# Altium schematic sheet [07] - CPU CONNECTORS .SchDoc (part 1 of 2)
size A2; Organization: Altium Limited; Address1: L3, 12a Rodborough Rd; Address2: Frenchs Forest; Address3: NSW; Address4: Australia 2086; DocumentNumber: 7; SheetNumber: 7; SheetTotal: 11
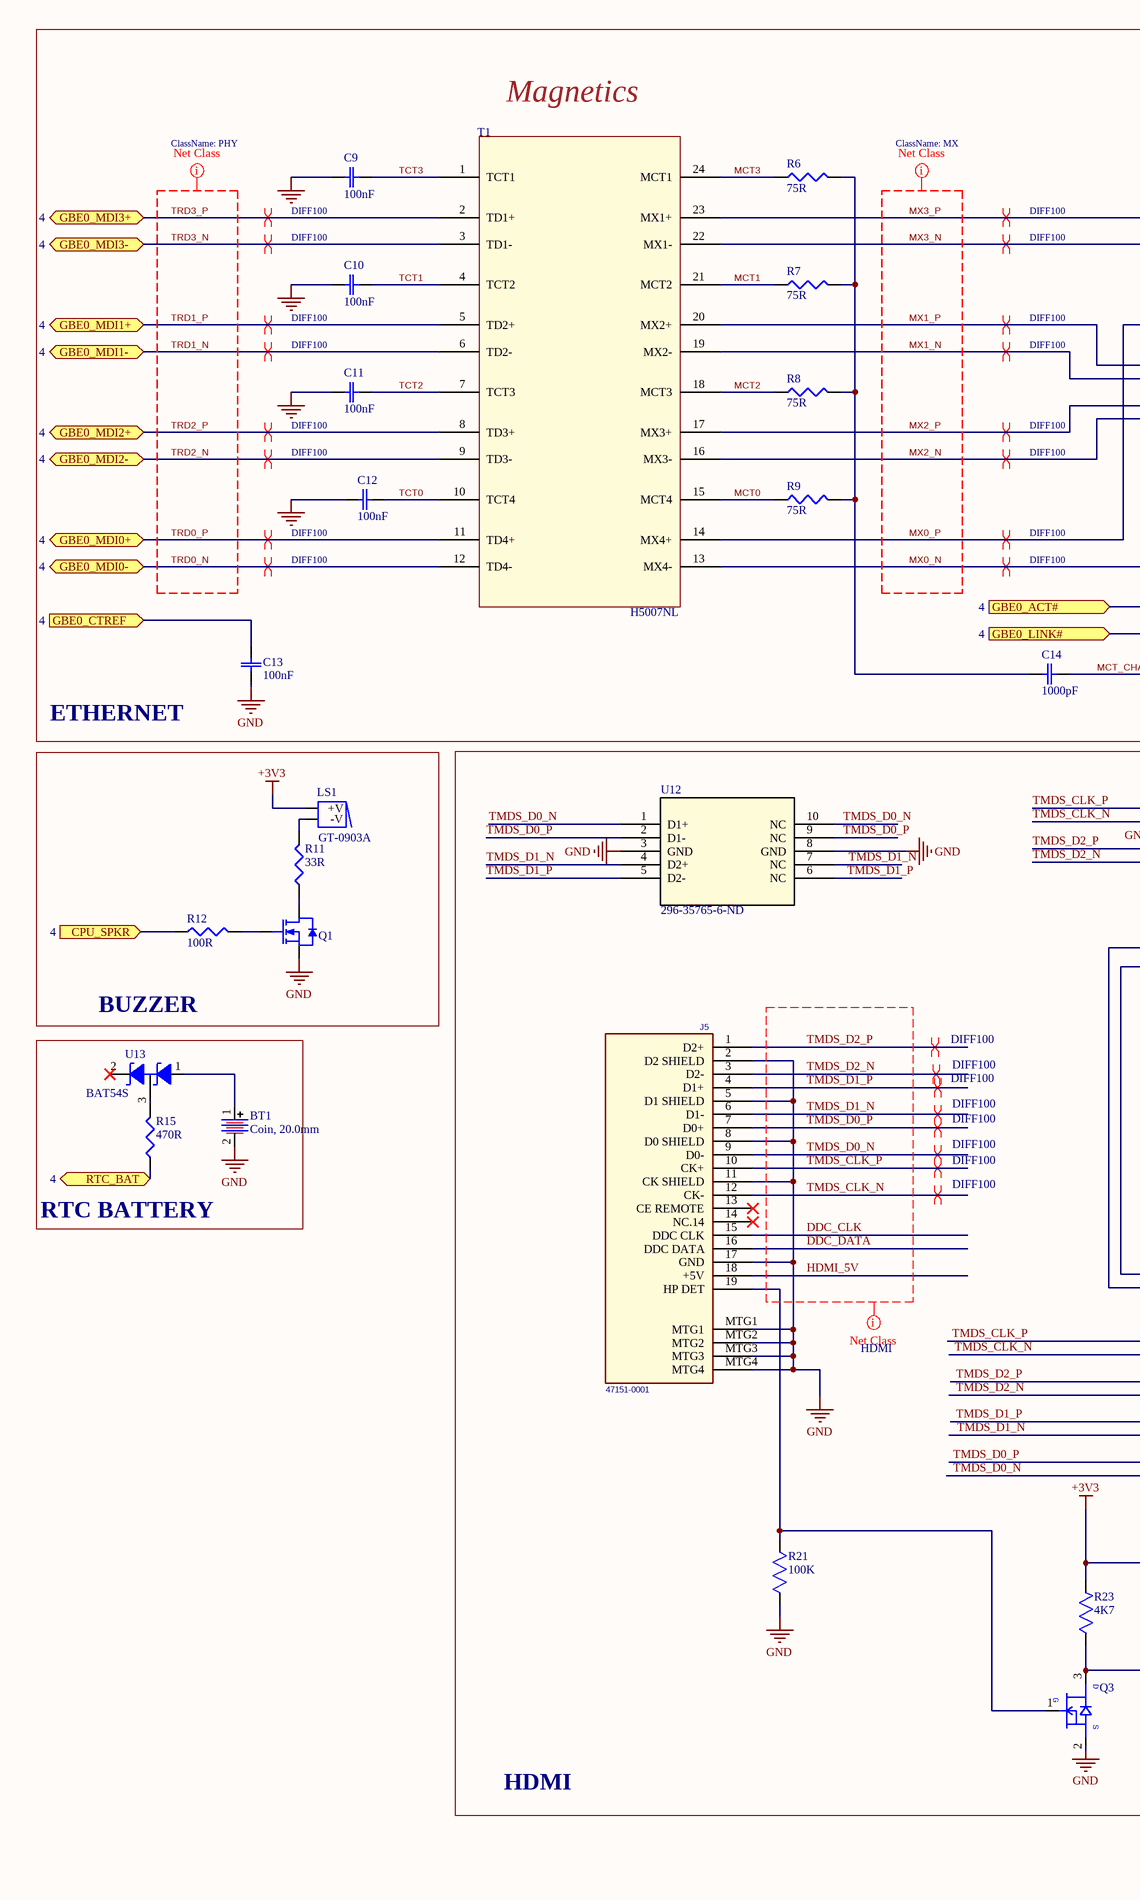
[diagram p0: [07] - CPU CONNECTORS .SchDoc, left]
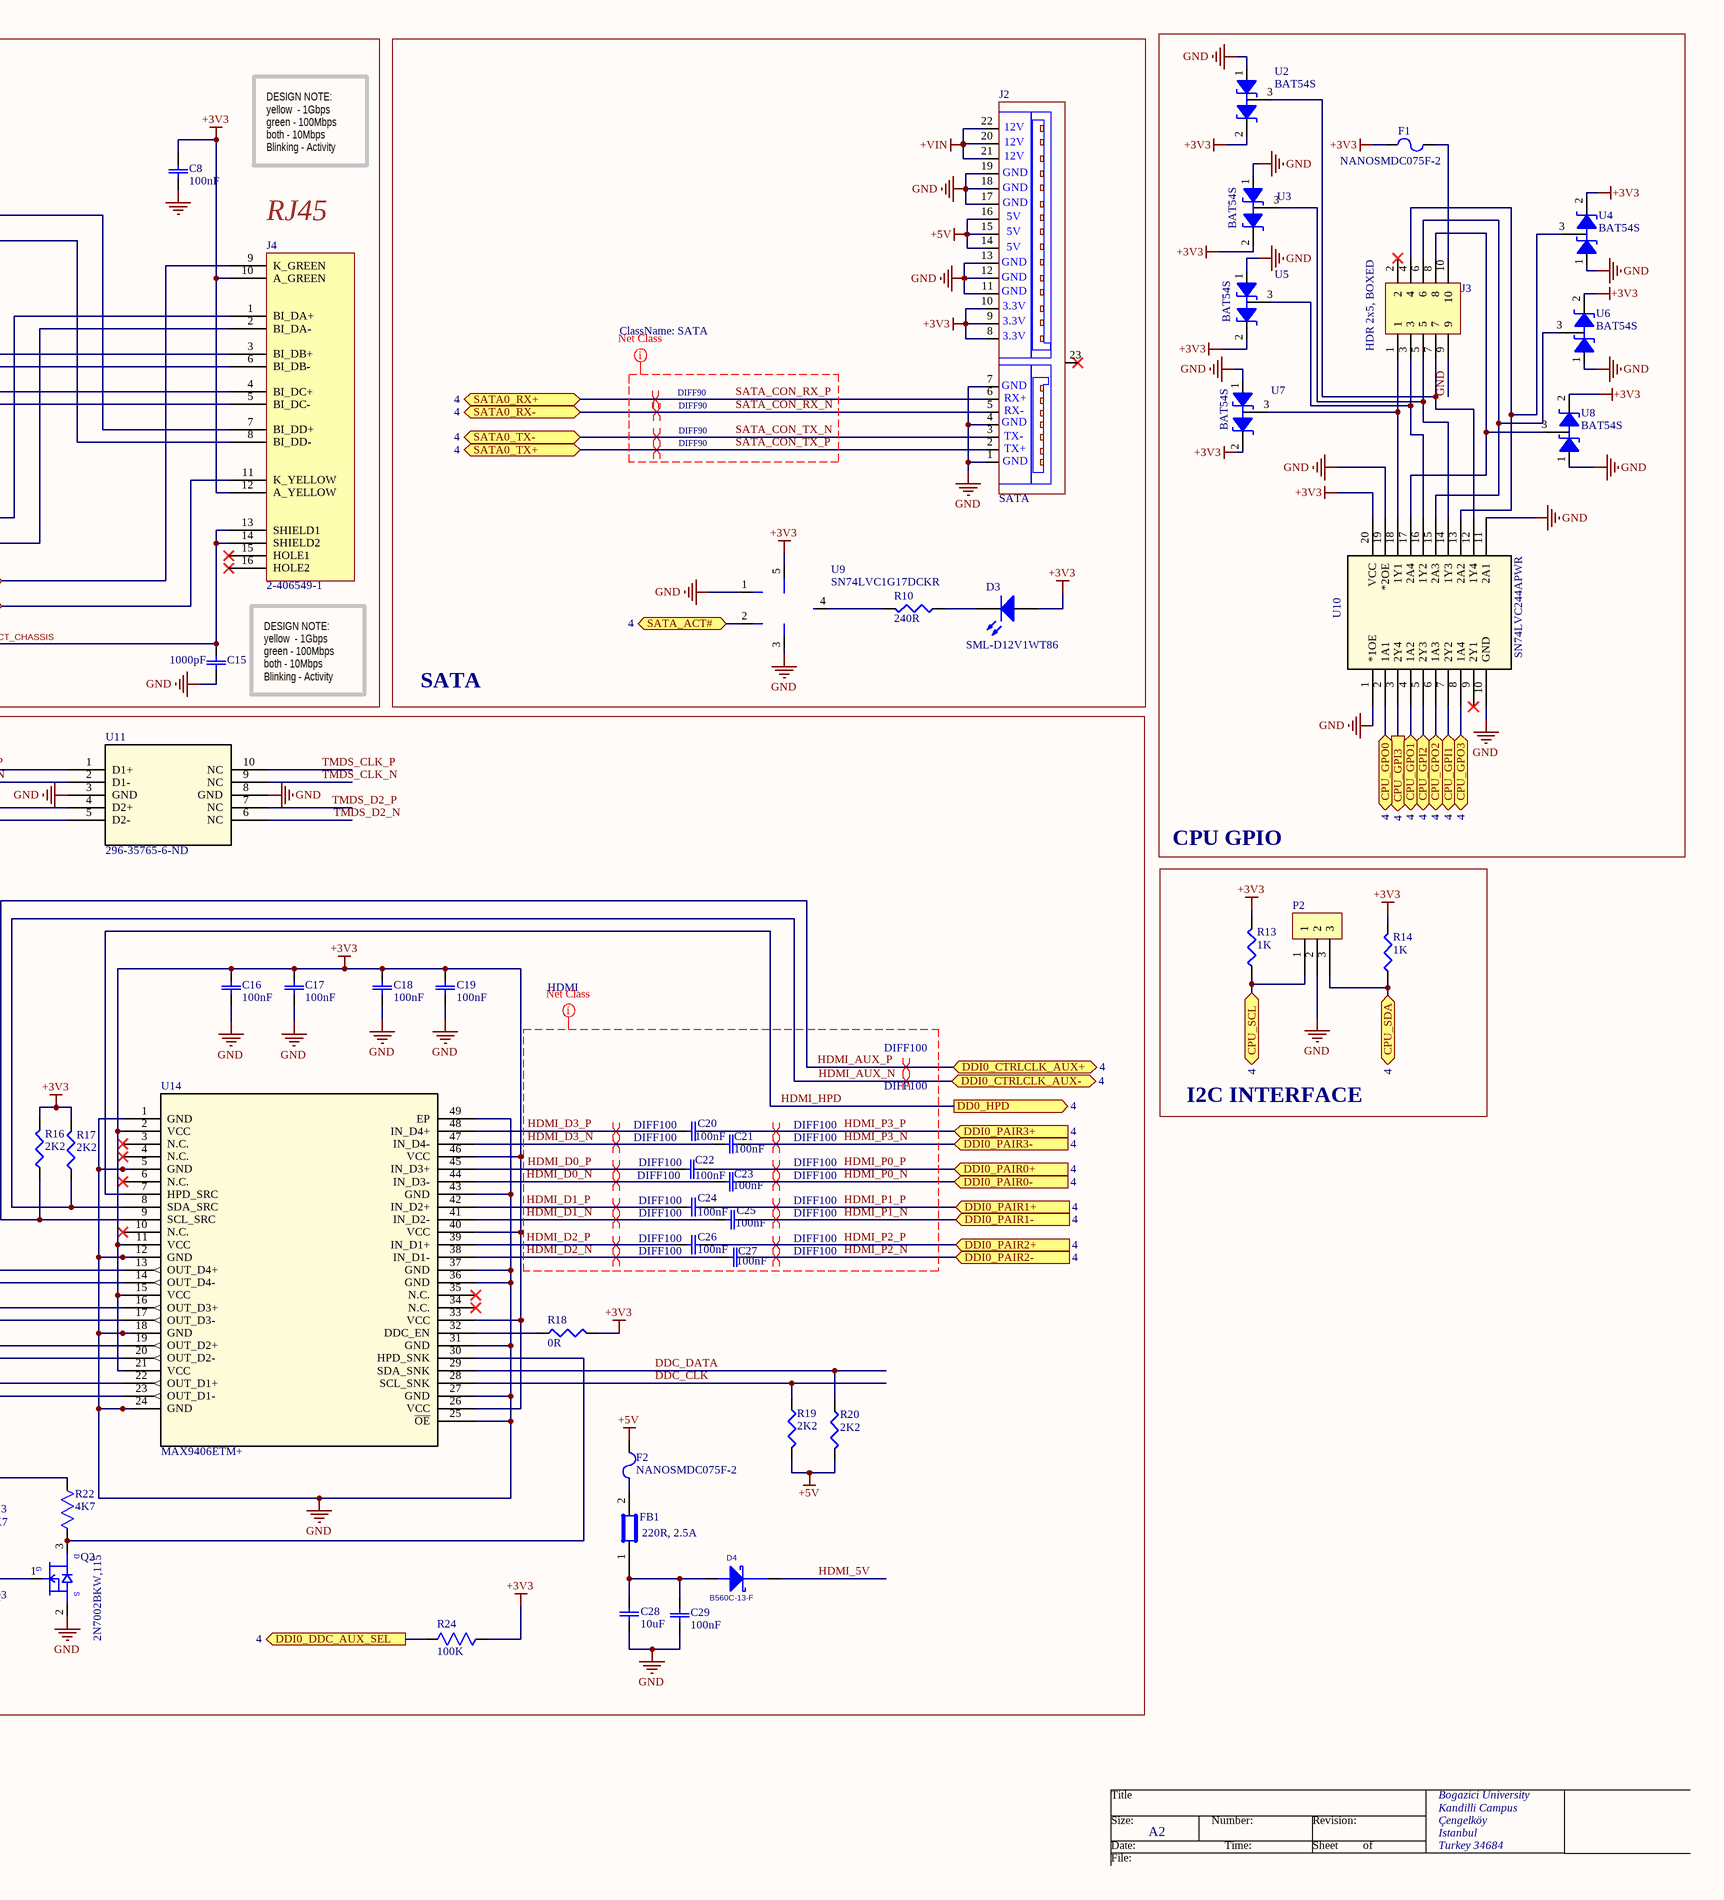
[diagram p1: [07] - CPU CONNECTORS .SchDoc, right]

## Parts
BT1  Coin, 20.0mm  [BS-7]
C8  100nF  [C0402]
C9  100nF  [C0402]
C10  100nF  [C0402]
C11  100nF  [C0402]
C12  100nF  [C0402]
C13  100nF  [C0402]
C14  1000pF  [C1206]
C15  1000pF  [C1206]
C16  100nF  [C0402]
C17  100nF  [C0402]
C18  100nF  [C0402]
C19  100nF  [C0402]
C20  100nF  [CAP_1608]
C21  100nF  [CAP_1608]
C22  100nF  [CAP_1608]
C23  100nF  [CAP_1608]
C24  100nF  [CAP_1608]
C25  100nF  [CAP_1608]
C26  100nF  [CAP_1608]
C27  100nF  [CAP_1608]
C28  10uF  [CAP_3216]
C29  100nF  [C0402]
D3  SML-D12V1WT86  [D0603_Directional]
D4  B560C-13-F  [SMC]
F1  NANOSMDC075F-2  [FUS_NANO_TYCO]
F2  NANOSMDC075F-2  [FUS_NANO_TYCO]
FB1  220R, 2.5A  [C0603]
J2  SATA  [SATA_Recepticle]
J3  HDR 2x5, BOXED  [HDR_2X5_2.54MM_BOXED]
J4  2-406549-1  [RJ45LED]
J5  47151-0001  [HDMI]
LS1  GT-0903A  [GT-0903A]
P2  76384-303LF  [HDR_1x3_2.54MM_SHDR_V2]  (value not drawn)
Q1  MOSFET N-CH 20V 1A SOT323  [SC70_SOT323]  (value not drawn)
Q2  2N7002BKW,115  [SC70_SOT323]
Q3  2N7002BKW,115  [SC70_SOT323]  (value not drawn)
R6  75R  [R0402]
R7  75R  [R0402]
R8  75R  [R0402]
R9  75R  [R0402]
R10  240R  [R0402]
R11  33R  [R0402]
R12  100R  [R0402]
R13  1K  [R0402]
R14  1K  [R0402]
R15  470R  [R0402]
R16  2K2  [R0402]
R17  2K2  [R0402]
R18  0R  [R0402]
R19  2K2  [R0402]
R20  2K2  [R0402]
R21  100K  [STA_RNCP0805-M]
R22  4K7  [RES0805_CRG_TYCO]
R23  4K7  [RES0805_CRG_TYCO]
R24  100K  [STA_RNCP0805-M]
T1  H5007NL  [H5007NL]
U2  BAT54S  [SOT-23]
U3  BAT54S  [SOT-23]
U4  BAT54S  [SOT-23]
U5  BAT54S  [SOT-23]
U6  BAT54S  [SOT-23]
U7  BAT54S  [SOT-23]
U8  BAT54S  [SOT-23]
U9  SN74LVC1G17DCKR  [DCK5]
U10  SN74LVC244APWR  [PW20]
U11  296-35765-6-ND  [DQA10]
U12  296-35765-6-ND  [DQA10]
U13  BAT54S  [SOT-23]
U14  MAX9406ETM+  [21-0144H_T4877-6]

## Blocks framed on the sheet
SATA: D3 J2 R10 U9
CPU GPIO: F1 J3 U2-U8 U10
BUZZER: LS1 Q1 R11 R12
HDMI: C16-C29 D4 F2 FB1 J5 Q2 Q3 R16-R24 U11 U12 U14
RTC BATTERY: BT1 R15 U13

## Ports
CPU_GPI1 (bidir, see 4), CPU_GPI2 (bidir, see 4), CPU_GPI3 (out, see 4), CPU_GPO0 (bidir, see 4), CPU_GPO1 (bidir, see 4), CPU_GPO2 (bidir, see 4), CPU_GPO3 (bidir, see 4), CPU_SCL (bidir, see 4), CPU_SDA (bidir, see 4), CPU_SPKR (in, see 4), DD0_HPD (out, see 4), DDI0_CTRLCLK_AUX+ (bidir, see 4), DDI0_CTRLCLK_AUX- (bidir, see 4), DDI0_DDC_AUX_SEL (out, see 4), DDI0_PAIR0+ (in, see 4), DDI0_PAIR0- (in, see 4), DDI0_PAIR1+ (in, see 4), DDI0_PAIR1- (in, see 4), DDI0_PAIR2+ (in, see 4), DDI0_PAIR2- (in, see 4), DDI0_PAIR3+ (in, see 4), DDI0_PAIR3- (in, see 4), GBE0_ACT# (in, see 4), GBE0_CTREF (in, see 4), GBE0_LINK# (in, see 4), GBE0_MDI0+ (bidir, see 4), GBE0_MDI0- (bidir, see 4), GBE0_MDI1+ (bidir, see 4), GBE0_MDI1- (bidir, see 4), GBE0_MDI2+ (bidir, see 4), GBE0_MDI2- (bidir, see 4), GBE0_MDI3+ (bidir, see 4), GBE0_MDI3- (bidir, see 4), RTC_BAT (bidir, see 4), SATA0_RX+ (bidir, see 4), SATA0_RX- (bidir, see 4), SATA0_TX+ (bidir, see 4), SATA0_TX- (bidir, see 4), SATA_ACT# (bidir, see 4)

## Nets
+3V3: C8.2 C16.2 C17.2 C18.2 C19.2 D3.1(A) F1.2 J2.8 J2.9 J2.10 J4.10(A_GREEN) J4.12(A_YELLOW) LS1.1(+V) R13.2 R14.2 R16.2 R17.2 R18.2 R22.1 R23.1 R24.1 U2.2 U3.2 U4.2 U5.2 U6.2 U7.2 U8.2 U9.5(VCC) U10.20(VCC) U14.2(VCC) U14.11(VCC) U14.15(VCC) U14.21(VCC) U14.26(VCC) U14.33(VCC) U14.40(VCC) U14.46(VCC)
+5V: F2.2 J2.14 J2.15 J2.16 R19.2 R20.2
+VIN: J2.20 J2.21 J2.22
GND: BT1.2 C8.1 C9.1 C10.1 C11.1 C12.1 C13.1 C15.2 C16.1 C17.1 C18.1 C19.1 C28.1 C29.1 J2.1 J2.4 J2.7 J2.11 J2.12 J2.13 J2.17 J2.18 J2.19 J3.9 J5.2(D2_SHIELD) J5.5(D1_SHIELD) J5.8(D0_SHIELD) J5.11(CK_SHIELD) J5.17(GND) J5.MTG1 J5.MTG2 J5.MTG3 J5.MTG4 P2.2 Q1.2(S) Q2.2(SOURCE) Q3.2(SOURCE) R21.2 U2.1 U3.1 U4.1 U5.1 U6.1 U7.1 U8.1 U9.1(NC) U9.3(GND) U10.1(*1OE) U10.10(GND) U10.11(2A1) U10.19(*2OE) U11.3(GND) U11.8(GND) U12.3(GND) U12.8(GND) U14.1(GND) U14.5(GND) U14.12(GND) U14.18(GND) U14.24(GND) U14.25(~{OE}) U14.27(GND) U14.31(GND) U14.36(GND) U14.37(GND) U14.43(GND) U14.49(EP)
CPU_GPI1: U10.7(2Y2) ; port CPU_GPI1
CPU_GPI2: U10.5(2Y3) ; port CPU_GPI2
CPU_GPI3: U10.3(2Y4) ; port CPU_GPI3
CPU_GPO0: U10.2(1A1) ; port CPU_GPO0
CPU_GPO1: U10.4(1A2) ; port CPU_GPO1
CPU_GPO2: U10.6(1A3) ; port CPU_GPO2
CPU_GPO3: U10.8(1A4) ; port CPU_GPO3
CPU_SCL: P2.1 R13.1 ; port CPU_SCL
CPU_SDA: P2.3 R14.1 ; port CPU_SDA
CPU_SPKR: R12.1 ; port CPU_SPKR
DDC_CLK: J5.15(DDC_CLK) R19.1 U14.28(SCL_SNK)
DDC_DATA: J5.16(DDC_DATA) R20.1 U14.29(SDA_SNK)
DDI0_DDC_AUX_SEL: R24.2 ; port DDI0_DDC_AUX_SEL
GBE0_ACT#: J4.9(K_GREEN) ; port GBE0_ACT#
GBE0_CTREF: C13.2 ; port GBE0_CTREF
GBE0_LINK#: J4.11(K_YELLOW) ; port GBE0_LINK#
HDMI_5V: D4.1(cathode) J5.18(+5V)
HDMI_AUX_N: R17.1 U14.8(SDA_SRC) ; port DDI0_CTRLCLK_AUX-
HDMI_AUX_P: R16.1 U14.9(SCL_SRC) ; port DDI0_CTRLCLK_AUX+
HDMI_D0_N: C23.1 U14.44(IN_D3-)
HDMI_D0_P: C22.1 U14.45(IN_D3+)
HDMI_D1_N: C25.1 U14.41(IN_D2-)
HDMI_D1_P: C24.1 U14.42(IN_D2+)
HDMI_D2_N: C27.1 U14.38(IN_D1-)
HDMI_D2_P: C26.1 U14.39(IN_D1+)
HDMI_D3_N: C21.1 U14.47(IN_D4-)
HDMI_D3_P: C20.1 U14.48(IN_D4+)
HDMI_HPD: U14.7(HPD_SRC) ; port DD0_HPD
HDMI_P0_N: C23.2 ; port DDI0_PAIR0-
HDMI_P0_P: C22.2 ; port DDI0_PAIR0+
HDMI_P1_N: C25.2 ; port DDI0_PAIR1-
HDMI_P1_P: C24.2 ; port DDI0_PAIR1+
HDMI_P2_N: C27.2 ; port DDI0_PAIR2-
HDMI_P2_P: C26.2 ; port DDI0_PAIR2+
HDMI_P3_N: C21.2 ; port DDI0_PAIR3-
HDMI_P3_P: C20.2 ; port DDI0_PAIR3+
MCT0: R9.1 T1.15(MCT4)
MCT1: R7.1 T1.21(MCT2)
MCT2: R8.1 T1.18(MCT3)
MCT3: R6.1 T1.24(MCT1)
MCT_CHASSIS: C14.1 C15.1 J4.13(SHIELD1) J4.14(SHIELD2)
MX0_N: J4.2(BI_DA-) T1.13(MX4-)
MX0_P: J4.1(BI_DA+) T1.14(MX4+)
MX1_N: J4.6(BI_DB-) T1.19(MX2-)
MX1_P: J4.3(BI_DB+) T1.20(MX2+)
MX2_N: J4.5(BI_DC-) T1.16(MX3-)
MX2_P: J4.4(BI_DC+) T1.17(MX3+)
MX3_N: J4.8(BI_DD-) T1.22(MX1-)
MX3_P: J4.7(BI_DD+) T1.23(MX1+)
RTC_BAT: R15.1 ; port RTC_BAT
SATA_ACT#: U9.2(A) ; port SATA_ACT#
SATA_CON_RX_N: J2.5 ; port SATA0_RX-
SATA_CON_RX_P: J2.6 ; port SATA0_RX+
SATA_CON_TX_N: J2.3 ; port SATA0_TX-
SATA_CON_TX_P: J2.2 ; port SATA0_TX+
TCT0: C12.2 T1.10(TCT4)
TCT1: C10.2 T1.4(TCT2)
TCT2: C11.2 T1.7(TCT3)
TCT3: C9.2 T1.1(TCT1)
TMDS_CLK_N: J5.12(CK-) U11.2(D1-) U11.9(NC) U14.14(OUT_D4-)
TMDS_CLK_P: J5.10(CK+) U11.1(D1+) U11.10(NC) U14.13(OUT_D4+)
TMDS_D0_N: J5.9(D0-) U12.1(D1+) U12.10(NC) U14.23(OUT_D1-)
TMDS_D0_P: J5.7(D0+) U12.2(D1-) U12.9(NC) U14.22(OUT_D1+)
TMDS_D1_N: J5.6(D1-) U12.4(D2+) U12.7(NC) U14.20(OUT_D2-)
TMDS_D1_P: J5.4(D1+) U12.5(D2-) U12.6(NC) U14.19(OUT_D2+)
TMDS_D2_N: J5.3(D2-) U11.5(D2-) U11.6(NC) U14.17(OUT_D3-)
TMDS_D2_P: J5.1(D2+) U11.4(D2+) U11.7(NC) U14.16(OUT_D3+)
TRD0_N: T1.12(TD4-) ; port GBE0_MDI0-
TRD0_P: T1.11(TD4+) ; port GBE0_MDI0+
TRD1_N: T1.6(TD2-) ; port GBE0_MDI1-
TRD1_P: T1.5(TD2+) ; port GBE0_MDI1+
TRD2_N: T1.9(TD3-) ; port GBE0_MDI2-
TRD2_P: T1.8(TD3+) ; port GBE0_MDI2+
TRD3_N: T1.3(TD1-) ; port GBE0_MDI3-
TRD3_P: T1.2(TD1+) ; port GBE0_MDI3+
NetBT1_1: BT1.1 U13.1
NetC14_2: C14.2 R6.2 R7.2 R8.2 R9.2
NetC28_2: C28.2 C29.2 D4.2(ANODE) FB1.1
NetD3_2: D3.2(K) R10.1
NetF1_1: F1.1 J3.10
NetF2_1: F2.1 FB1.2
NetJ3_1: J3.1 U7.3 U10.18(1Y1)
NetJ3_3: J3.3 U5.3 U10.16(1Y2)
NetJ3_4: J3.4 U4.3 U10.13(2A2)
NetJ3_5: J3.5 U3.3 U10.14(1Y3)
NetJ3_6: J3.6 U6.3 U10.15(2A3)
NetJ3_7: J3.7 U2.3 U10.12(1Y4)
NetJ3_8: J3.8 U8.3 U10.17(2A4)
NetJ5_19: J5.19(HP_DET) Q3.1(GATE) R21.1
NetLS1_2: LS1.2(-V) R11.2
NetQ1_1: Q1.1(G) R12.2
NetQ1_3: Q1.3(D) R11.1
NetQ2_1: Q2.1(GATE) Q3.3(DRAIN) R23.2
NetQ2_3: Q2.3(DRAIN) R22.2 U14.30(HPD_SNK)
NetR10_2: R10.2 U9.4(Y)
NetR15_2: R15.2 U13.3
NetR18_1: R18.1 U14.32(DDC_EN)

Not connected (* = marked no-connect by the designer): J2 23*; J3 2*; J4 15(HOLE1)* 16(HOLE2)*; J5 13(CE_REMOTE)* 14(NC.14)*; U10 9(2Y1)*; U13 2*; U14 3(N.C.)* 4(N.C.)* 6(N.C.)* 10(N.C.)* 34(N.C.)* 35(N.C.)*

## Layout directives
differential pair; net class DIFF100: HDMI_AUX_N, HDMI_AUX_P, HDMI_D0_N, HDMI_D0_P, HDMI_D1_N, HDMI_D1_P, HDMI_D2_N, HDMI_D2_P, HDMI_D3_N, HDMI_D3_P, HDMI_P0_N, HDMI_P0_P, HDMI_P1_N, HDMI_P1_P, HDMI_P2_N, HDMI_P2_P, HDMI_P3_N, HDMI_P3_P, MX0_N, MX0_P, MX1_N, MX1_P, MX2_N, MX2_P, MX3_N, MX3_P, TMDS_CLK_N, TMDS_CLK_P, TMDS_D0_N, TMDS_D0_P, TMDS_D1_N, TMDS_D1_P, TMDS_D2_N, TMDS_D2_P, TRD0_N, TRD0_P, TRD1_N, TRD1_P, TRD2_N, TRD2_P, TRD3_N, TRD3_P
net class PHY: TRD0_N, TRD0_P, TRD1_N, TRD1_P, TRD2_N, TRD2_P, TRD3_N, TRD3_P
net class MX: MX0_N, MX0_P, MX1_N, MX1_P, MX2_N, MX2_P, MX3_N, MX3_P
differential pair; net class DIFF90: SATA_CON_RX_N, SATA_CON_RX_P, SATA_CON_TX_N, SATA_CON_TX_P
net class SATA: SATA_CON_RX_N, SATA_CON_RX_P, SATA_CON_TX_N, SATA_CON_TX_P
net class HDMI: DDC_CLK, DDC_DATA, HDMI_5V, HDMI_AUX_N, HDMI_AUX_P, HDMI_D0_N, HDMI_D0_P, HDMI_D1_N, HDMI_D1_P, HDMI_D2_N, HDMI_D2_P, HDMI_D3_N, HDMI_D3_P, HDMI_HPD, HDMI_P0_N, HDMI_P0_P, HDMI_P1_N, HDMI_P1_P, HDMI_P2_N, HDMI_P2_P, HDMI_P3_N, HDMI_P3_P, TMDS_CLK_N, TMDS_CLK_P, TMDS_D0_N, TMDS_D0_P, TMDS_D1_N, TMDS_D1_P, TMDS_D2_N, TMDS_D2_P

## Notes on the sheet
- Magnetics
- DESIGN NOTE:
  yellow  - 1Gbps
  green - 100Mbps
  both - 10Mbps
  Blinking - Activity
- (near J4) RJ45
- ETHERNET
- I2C INTERFACE
- Title
- Bogazici University
- Size:
- Date:
- File:
- A2
- Number:
- Time:
- Revision:
- Sheet
- of
- Kandilli Campus
- Çengelköy
- Istanbul
- Turkey 34684
- (in symbol 2N7002BKW,115) D; G; S
- (in symbol SATA) 12V; GND; 5V; 3.3V; RX+; RX-; TX-; TX+